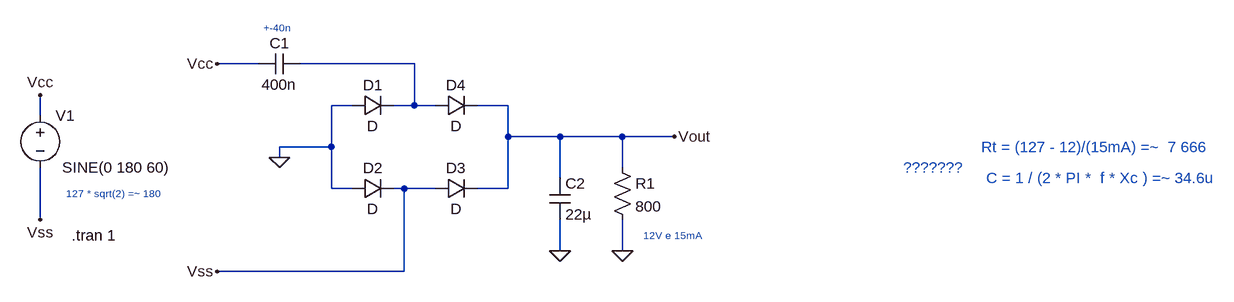
[diagram p0: schematic Draft2.asc]
Draft2.asc, the LTspice schematic file:
Version 4
SHEET 1 1208 680
WIRE -320 0 -384 0
WIRE -80 0 -256 0
WIRE -176 64 -208 64
WIRE -80 64 -80 0
WIRE -80 64 -112 64
WIRE -48 64 -80 64
WIRE 64 64 16 64
WIRE -656 80 -656 48
WIRE 64 112 64 64
WIRE 144 112 64 112
WIRE 240 112 144 112
WIRE 320 112 240 112
WIRE -208 128 -208 64
WIRE -208 128 -288 128
WIRE -288 144 -288 128
WIRE 240 160 240 112
WIRE 144 176 144 112
WIRE -208 192 -208 128
WIRE -176 192 -208 192
WIRE -96 192 -112 192
WIRE -48 192 -96 192
WIRE 64 192 64 112
WIRE 64 192 16 192
WIRE -656 240 -656 160
WIRE 144 288 144 240
WIRE 240 288 240 240
WIRE -96 320 -96 192
WIRE -96 320 -384 320
FLAG 320 112 Vout
FLAG -384 0 Vcc
FLAG -656 48 Vcc
FLAG 240 288 0
FLAG -288 144 0
FLAG -656 240 Vss
FLAG -384 320 Vss
FLAG 144 288 0
SYMBOL voltage -656 64 R0
WINDOW 123 0 0 Left 0
WINDOW 39 0 0 Left 0
WINDOW 3 34 96 Left 2
SYMATTR Value SINE(0 180 60)
SYMATTR InstName V1
SYMBOL res 224 144 R0
SYMATTR InstName R1
SYMATTR Value 800
SYMBOL cap -256 -16 R90
WINDOW 0 0 32 VBottom 2
WINDOW 3 32 32 VTop 2
SYMATTR InstName C1
SYMATTR Value 400n
SYMBOL diode -176 80 R270
WINDOW 0 32 32 VTop 2
WINDOW 3 0 32 VBottom 2
SYMATTR InstName D1
SYMBOL diode -176 208 R270
WINDOW 0 32 32 VTop 2
WINDOW 3 0 32 VBottom 2
SYMATTR InstName D2
SYMBOL diode -48 208 R270
WINDOW 0 32 32 VTop 2
WINDOW 3 0 32 VBottom 2
SYMATTR InstName D3
SYMBOL diode -48 80 R270
WINDOW 0 32 32 VTop 2
WINDOW 3 0 32 VBottom 2
SYMATTR InstName D4
SYMBOL cap 128 176 R0
SYMATTR InstName C2
SYMATTR Value 22µ
TEXT -608 264 Left 2 !.tran 1
TEXT -616 200 Left 1 ;127 * sqrt(2) =~ 180
TEXT 272 264 Left 1 ;12V e 15mA
TEXT 792 128 Left 2 ;Rt = (127 - 12)/(15mA) =~  7 666
TEXT 800 176 Left 2 ;C = 1 / (2 * PI *  f * Xc ) =~ 34.6u
TEXT 672 160 Left 2 ;???????
TEXT -312 -56 Left 1 ;+-40n

The netlist it stands for:
* Draft2.asc
V1 Vcc Vss SINE(0 180 60)
R1 Vout 0 800
C1 N001 Vcc 400n
D1 0 N001 D
D2 0 Vss D
D3 Vss Vout D
D4 N001 Vout D
C2 Vout 0 22µ
.model D D
.lib standard.dio
.tran 1
* 127 * sqrt(2) =~ 180
* 12V e 15mA
* Rt = (127 - 12)/(15mA) =~  7 666
* C = 1 / (2 * PI *  f * Xc ) =~ 34.6u
* ???????
* +-40n
.backanno
.end

* Results of the author's LTspice run, read from the files saved beside the schematic
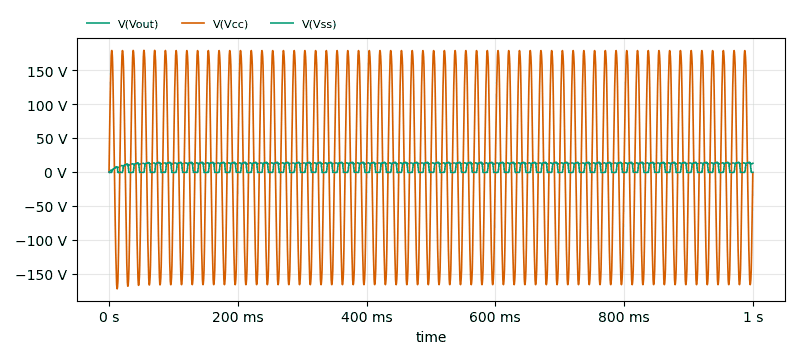
[diagram p1: Transient Analysis of Draft2.asc, plotted from the saved traces]
* Transient Analysis, 1 run:
*   V(Vout): min 0 V, max 13.43 V, average 12.53 V, rms 12.59 V, last 12.75 V
*   V(Vcc): min -172 V, max 179 V, average 6.27 V, rms 124.3 V, last -739.6 mV
*   V(Vss): min -740.2 mV, max 14.16 V, average 6.273 V, rms 9.176 V, last -739.6 mV